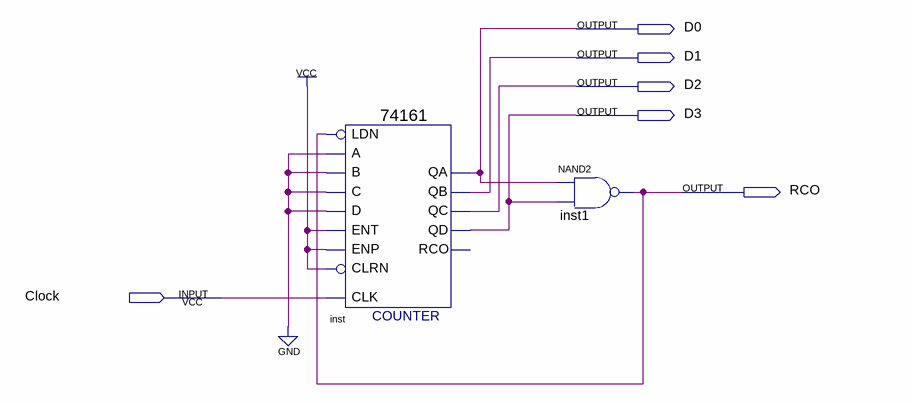
[diagram p0: schematic sheet]
// Quartus schematic mod10.bdf as structural Verilog: 2 symbols, 6 pins
module mod10 (
  input  Clock,
  output D0,
  output D1,
  output D2,
  output D3,
  output RCO
);

  \74161  inst (
    .CLRN(1'b1), .CLK(Clock), .ENP(1'b1), .LDN(RCO), .A(1'b0), .D(1'b0), .ENT(1'b1), .B(1'b0), .C(1'b0),
    .QD(D3), .QC(D2), .QB(D1), .QA(D0));  // open: RCO
  nand inst1 (RCO, D0, D3);
endmodule
